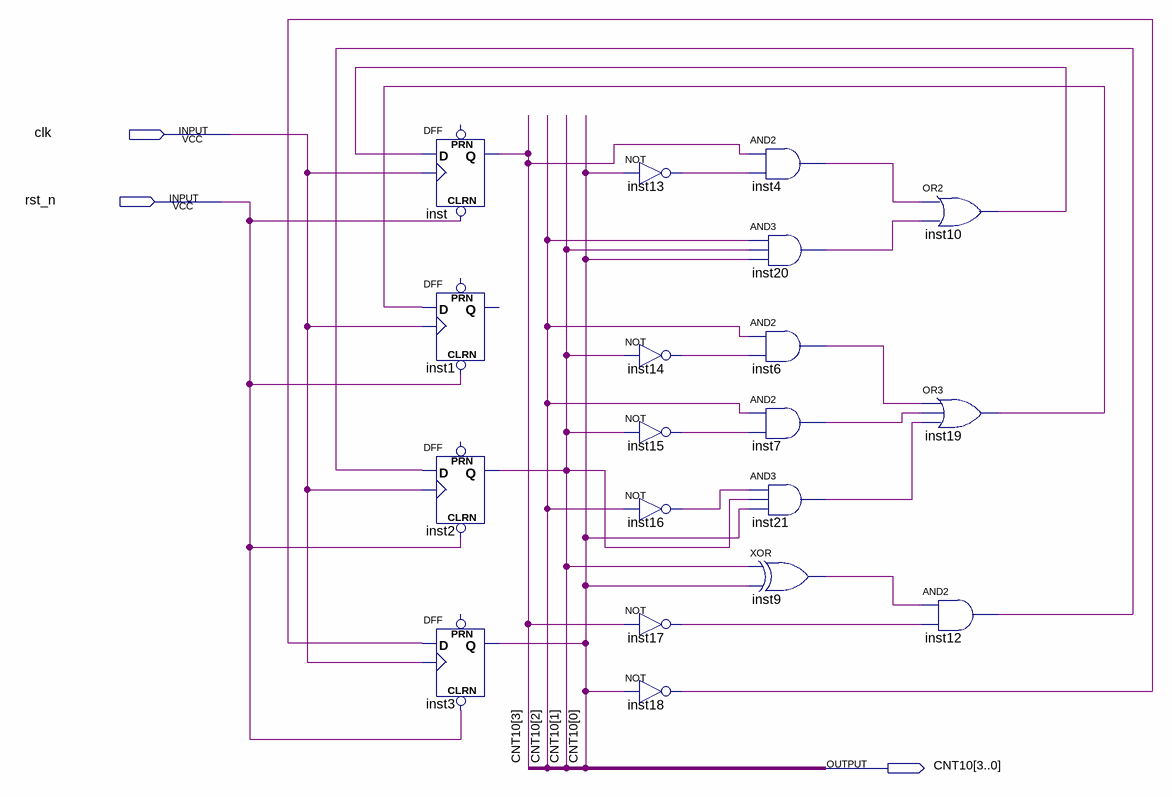
[diagram p0: schematic sheet]
// Quartus schematic counter.bdf as structural Verilog: 19 symbols, 3 pins
module counter (
  input  clk,
  input  rst_n,
  output [3:0] CNT10
);

  wire inst1_q, inst4_out, inst6_out, inst7_out, inst9_out, inst10_out, inst12_out, inst13_out, inst14_out,
       inst15_out, inst16_out, inst17_out, inst18_out, inst19_out, inst20_out, inst21_out;

  DFF inst (.CLRN(rst_n), .CLK(clk), .D(inst10_out), .Q(CNT10[3]));  // open: PRN
  DFF inst1 (.CLRN(rst_n), .CLK(clk), .D(inst19_out), .Q(inst1_q));  // open: PRN
  DFF inst2 (.CLRN(rst_n), .CLK(clk), .D(inst12_out), .Q(CNT10[1]));  // open: PRN
  DFF inst3 (.CLRN(rst_n), .CLK(clk), .D(inst18_out), .Q(CNT10[0]));  // open: PRN
  not inst13 (inst13_out, CNT10[0]);
  not inst14 (inst14_out, CNT10[1]);
  not inst15 (inst15_out, CNT10[1]);
  not inst16 (inst16_out, CNT10[2]);
  not inst17 (inst17_out, CNT10[3]);
  not inst18 (inst18_out, CNT10[0]);
  and inst4 (inst4_out, CNT10[3], inst13_out);
  and inst20 (inst20_out, CNT10[2], CNT10[1], CNT10[0]);
  and inst6 (inst6_out, CNT10[2], inst14_out);
  and inst7 (inst7_out, CNT10[2], inst15_out);
  and inst21 (inst21_out, inst16_out, CNT10[1], CNT10[0]);
  xor inst9 (inst9_out, CNT10[1], CNT10[0]);
  or inst10 (inst10_out, inst4_out, inst20_out);
  or inst19 (inst19_out, inst6_out, inst7_out, inst21_out);
  and inst12 (inst12_out, inst9_out, inst17_out);
endmodule
